# Altium schematic sheet Sheet1.SchDoc
size A
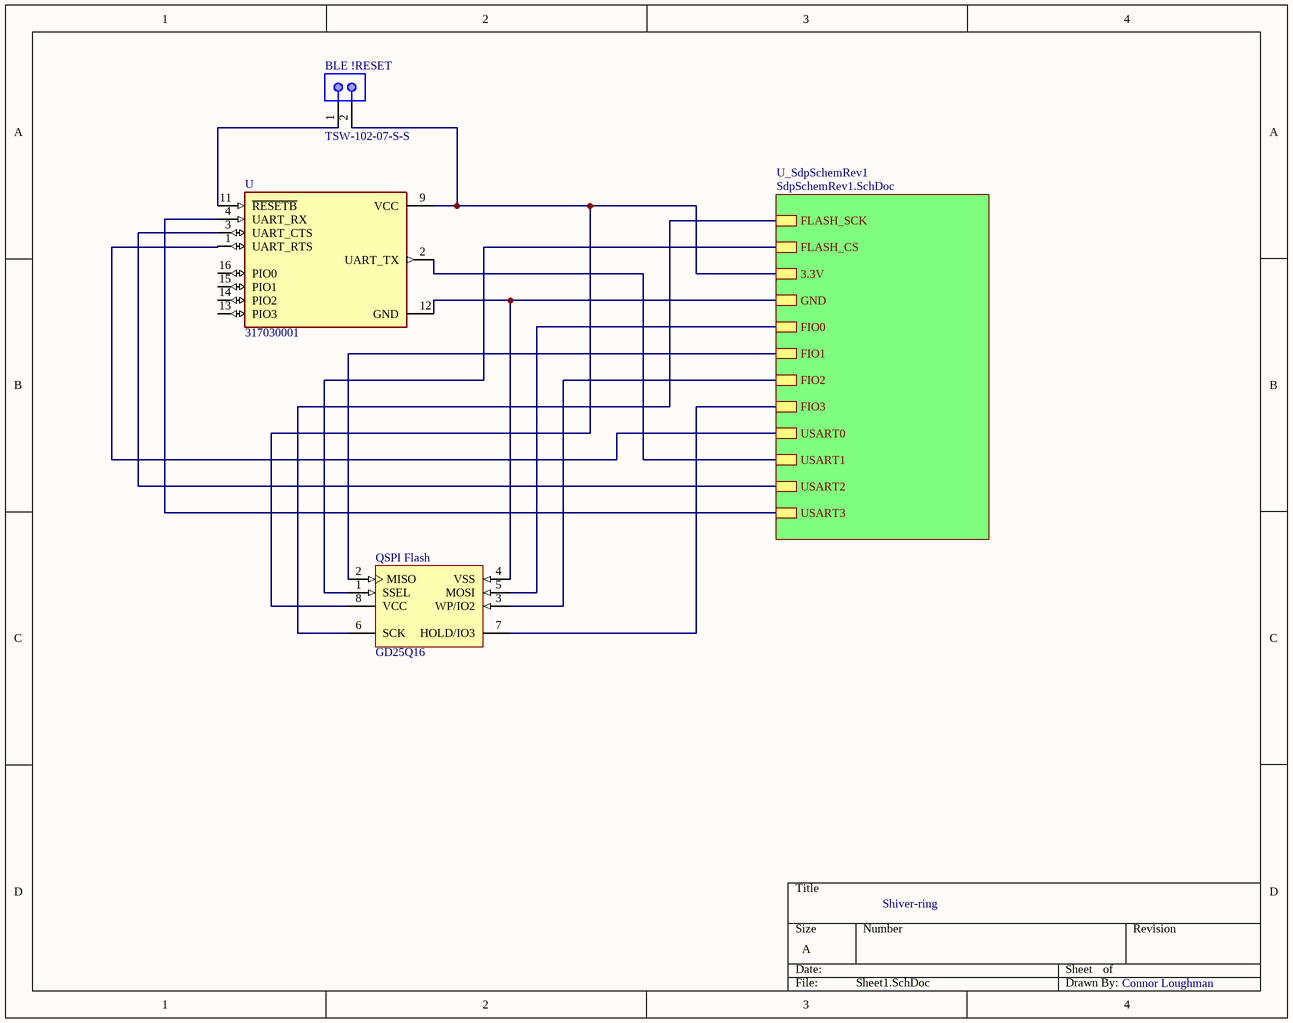
[diagram p0: Sheet1.SchDoc]

## Parts
BLE_!RESET  TSW-102-07-S-S  [SMTC-TSW-102-07-S-S]
QSPI_Flash  GD25Q16  [MICT-MN-8_N]
U  317030001  [XCVR_317030001]

## Sub-sheets
U_SdpSchemRev1 = SdpSchemRev1.SchDoc: FLASH_SCK, FLASH_CS, 3.3V, GND, FIO0, FIO1, FIO2, FIO3, USART0, USART1, USART2, USART3

## Nets
NetBLE_!RESET_1: BLE_!RESET.1 U.11(~{RESETB})
NetBLE_!RESET_2: BLE_!RESET.2 QSPI_Flash.8(VCC) U.9(VCC) ; sheet U_SdpSchemRev1/3.3V
NetQSPI_Flash_1: QSPI_Flash.1(SSEL) ; sheet U_SdpSchemRev1/FLASH_CS
NetQSPI_Flash_2: QSPI_Flash.2(MISO) ; sheet U_SdpSchemRev1/FIO1
NetQSPI_Flash_3: QSPI_Flash.3(WP/IO2) ; sheet U_SdpSchemRev1/FIO2
NetQSPI_Flash_4: QSPI_Flash.4(VSS) U.12(GND) ; sheet U_SdpSchemRev1/GND
NetQSPI_Flash_5: QSPI_Flash.5(MOSI) ; sheet U_SdpSchemRev1/FIO0
NetQSPI_Flash_6: QSPI_Flash.6(SCK) ; sheet U_SdpSchemRev1/FLASH_SCK
NetQSPI_Flash_7: QSPI_Flash.7(HOLD/IO3) ; sheet U_SdpSchemRev1/FIO3
NetU_1: U.1(UART_RTS) ; sheet U_SdpSchemRev1/USART0
NetU_2: U.2(UART_TX) ; sheet U_SdpSchemRev1/USART1
NetU_3: U.3(UART_CTS) ; sheet U_SdpSchemRev1/USART2
NetU_4: U.4(UART_RX) ; sheet U_SdpSchemRev1/USART3

Not connected (* = marked no-connect by the designer): U 13(PIO3) 14(PIO2) 15(PIO1) 16(PIO0)

## Notes on the sheet
- Shiver-ring
- Connor Loughman

## Library data of the parts
BLE_!RESET = CMP-1681-00004-4: Male Header, Pitch 2.54 mm, 1 x 2 Position, Height 8.38 mm, Tail Length 2.54 mm, -55 to 125 degC, RoHS, Bulk; Manufacturer: Samtec; Rows: 1; ComponentLink1URL: http://www.samtec.com/; Contact Finish: Gold; Mounting Technology: Through Hole; PackageReference: TSW-102-07-S-S; RoHSCompliant: true; Pins: 2; Contact Material: Bronze; ComponentLink2Description: Datasheet; Max Operating Temperature: 125 degC; Min Operating Temperature: -55 degC; Height: 8.38 mm; Packaging: Bulk; ComponentLink1Description: Manufacturer URL; PackageDescription: Male Header, Pitch 2.54 mm, 1 x 2 Position, Height 8.38 mm, Tail Length 2.54 mm; Colour: Black; Contact Plating: Gold; Length: 5.08 mm; ComponentLink2URL: http://suddendocs.samtec.com/catalog_english/tsw_th.pdf; DatasheetVersion: 12/2015; Mount: Through Hole; Lead Pitch: 0.1 inch; REACH SVHC: No SVHC; Package Quantity: 1
QSPI_Flash = CMP-0357-00068-1: 1 Mb (x1) Serial NOR Flash Memory with Page Erase, 75 MHz, 2.7 to 3.6 V, 8-pin SO8 Narrow (MN), Tube; Part Family: M45PE; Manufacturer: Micron; PartNumber: M45PE10-VMN6P; Speed: 75 MHz; Voltage: 2.7V-3.6V; Density: 1Mb; PackageReference: MICT-MN-8; PackageDescription: 8-Pin SO Narrow, 3.9 X 4.9 mm, Pitch 1.27 mm; Part Status: Production; Mounting Technology: Surface Mount; ComponentLink2Description: Datasheet; ComponentLink1URL: http://www.micron.com/; DatasheetVersion: Rev. 8; ComponentLink1Description: Manufacturer URL; Type: Page Erase; Applications: Embedded; Width: x1; ComponentLink3URL: http://www.micron.com/~/media/Documents/Products/Data%20Sheet/NOR%20Flash/Serial%20NOR/M25P/M25P05A.pdf; RoHS: Yes; ComponentLink2URL: http://www.micron.com/~/media/Documents/Products/Data%20Sheet/NOR%20Flash/Serial%20NOR/M25PE_M45PE/M45PE10.pdf; Package: SO8 Narrow; ComponentLink3Description: Package Specification; PackageVersion: Rev 11
U = 317030001: Bluetooth Bluetooth v4.0 Transceiver Module 2.4GHz Integrated, Trace Surface Mount; MF: Seeed Technology; Value: *; SnapEDA_Link: https://www.snapeda.com/parts/317030001/Seeed%20Technology%20Co.%2C%20Ltd/view-part/449174/?ref=snap; Digi-Key_Purchase_URL: https://www.digikey.kr/product-detail/en/seeed-technology-co-ltd/317030001/1597-1359-ND/5487659?utm_source=snapeda&utm_medium=aggregator&utm_campaign=symbol; MP: 317030001; Digi-Key_Part_Number: 1597-1359-ND; Package: Module Seeed Technology